# Altium schematic sheet IV_sensing.SchDoc: Triumvi - Sensing - IV Sensing
size Letter; Author: Ye-Sheng Kuo; Revision: 10; SheetNumber: 3; SheetTotal: 6
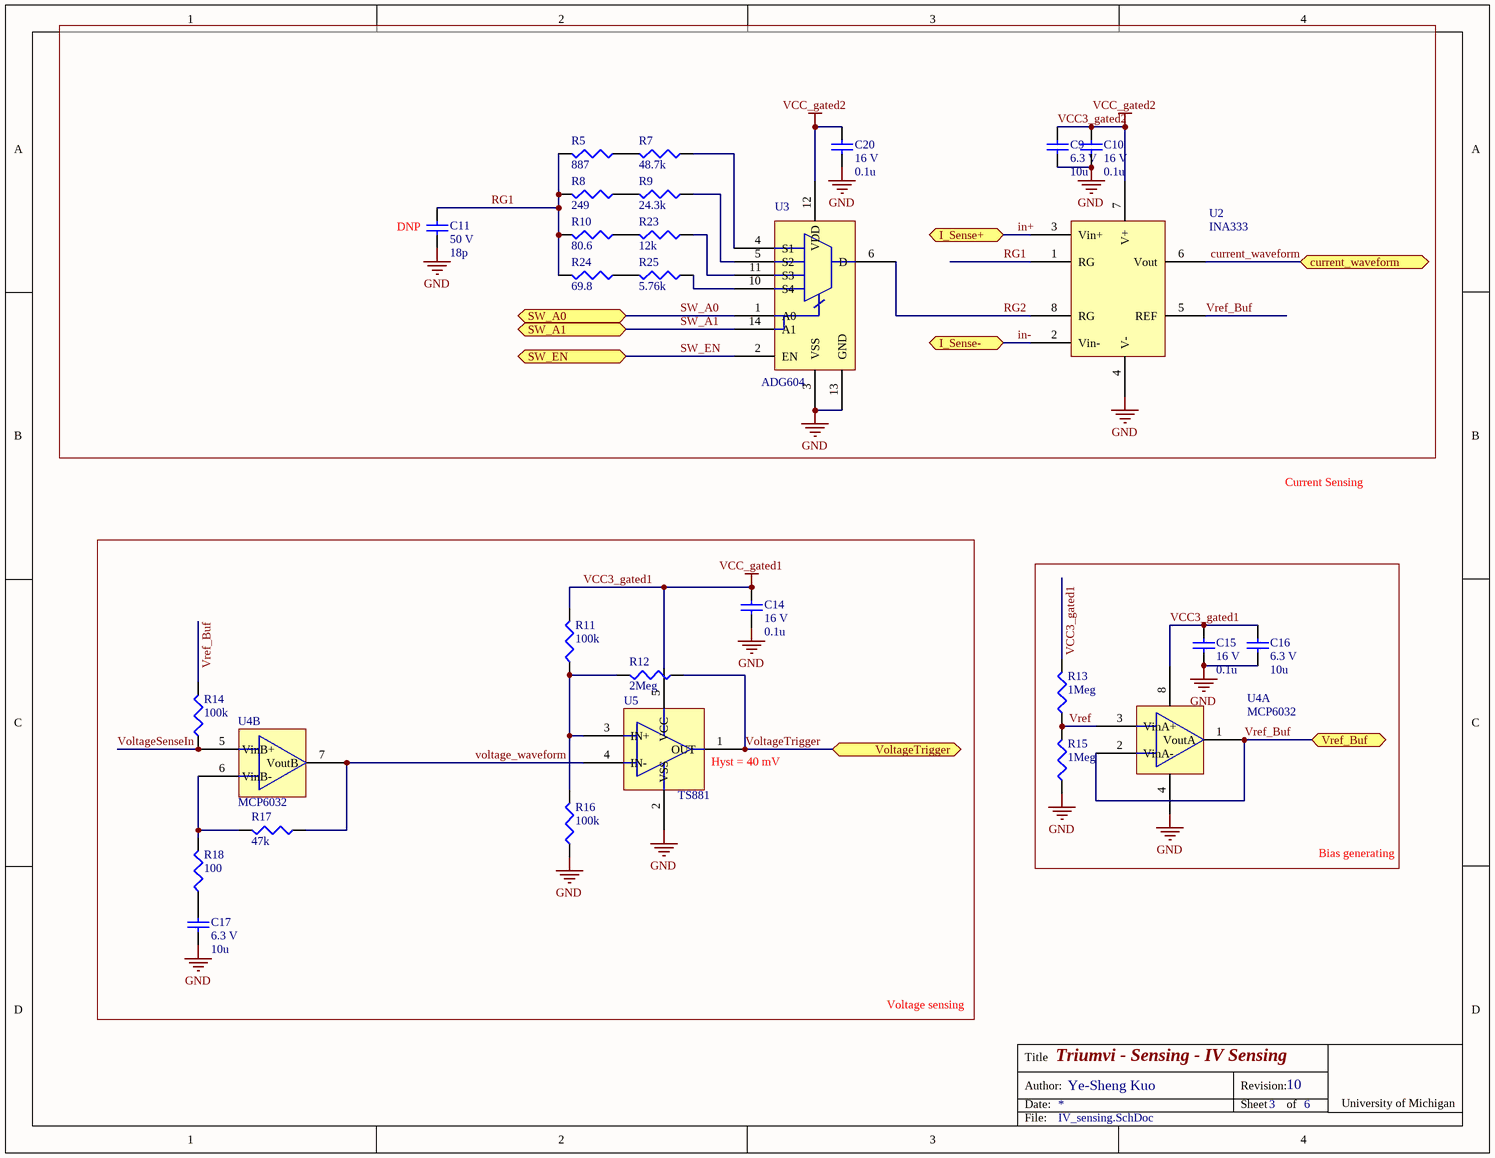
[diagram p0: IV_sensing.SchDoc]

## Parts
C9  voltage rated: 6.3 V  [0603]  (hidden comment: 10u)
C10  voltage rated: 16 V  [0402]  (hidden comment: 0.1u)
C11  voltage rated: 50 V  [0402]  (hidden comment: 18p)
C14  voltage rated: 16 V  [0402]  (hidden comment: 0.1u)
C15  voltage rated: 16 V  [0402]  (hidden comment: 0.1u)
C16  voltage rated: 6.3 V  [0603]  (hidden comment: 10u)
C17  voltage rated: 6.3 V  [0603]  (hidden comment: 10u)
C20  voltage rated: 16 V  [0402]  (hidden comment: 0.1u)
R5  887  [0402]
R7  48.7k  [0402]
R8  249  [0402]
R9  24.3k  [0402]
R10  80.6  [0402]
R11  100k  [0402]
R12  2Meg  [0402]
R13  1Meg  [0402]
R14  100k  [0402]
R15  1Meg  [0402]
R16  100k  [0402]
R17  47k  [0402]
R18  100  [0402]
R23  12k  [0402]
R24  69.8  [0402]
R25  5.76k  [0402]
U2  INA333  [MSOP-8]
U3  ADG604  [TSSOP-14]
U4  MCP6032  [MSOP-8]  (parts A,B of 2)
U5  TS881  [SC70-5]

## Blocks framed on the sheet
DNP: C9-C11 C20 R5 R7-R10 R23-R25 U2 U3
Bias generating: C15 C16 R13 R15 U4

## Ports
current_waveform, I_Sense+, I_Sense-, SW_A0, SW_A1, SW_EN, VoltageTrigger, Vref_Buf

## Nets
GND: C9.2 C10.2 C11.2 C14.2 C15.2 C16.2 C17.2 C20.2 R15.2 R16.2 U2.4(V-) U3.3(VSS) U3.13(GND) U4.4(VSS) U5.2(VSS)
VCC3_gated1: C14.1 C15.1 C16.1 R11.1 R13.1 U4.8(VDD) U5.5(VCC)  [also labelled VCC_gated1]
VCC3_gated2: C9.1 C10.1 C20.1 U2.7(V+) U3.12(VDD)  [also labelled VCC_gated2]
current_waveform: U2.6(Vout) ; port current_waveform
in+: U2.3(Vin+) ; port I_Sense+
in-: U2.2(Vin-) ; port I_Sense-
RG1: C11.1 R5.1 R8.1 R10.1 R24.1 U2.1(RG)
RG2: U2.8(RG) U3.6(D)
SW_A0: U3.1(A0) ; port SW_A0
SW_A1: U3.14(A1) ; port SW_A1
SW_EN: U3.2(EN) ; port SW_EN
voltage_waveform: R17.2 U4.7(VoutB) U5.4(IN-)
VoltageSenseIn: R14.2 U4.5(VinB+)
VoltageTrigger: R12.2 U5.1(OUT) ; port VoltageTrigger
Vref: R13.2 R15.1 U4.3(VinA+)
Vref_Buf: R14.1 U2.5(REF) U4.1(VoutA) U4.2(VinA-) ; port Vref_Buf
NetC17_1: C17.1 R18.2
NetR5_2: R5.2 R7.1
NetR7_2: R7.2 U3.4(S1)
NetR8_2: R8.2 R9.1
NetR9_2: R9.2 U3.5(S2)
NetR10_2: R10.2 R23.1
NetR11_2: R11.2 R12.1 R16.1 U5.3(IN+)
NetR17_1: R17.1 R18.1 U4.6(VinB-)
NetR23_2: R23.2 U3.11(S3)
NetR24_2: R24.2 R25.1
NetR25_2: R25.2 U3.10(S4)

## Notes on the sheet
- Current Sensing
- (near U5) Hyst = 40 mV
- Voltage sensing
- Title
- Date:
- Author:
- Revision:
- Sheet
- of
- University of Michigan
- File:

## Library data of the parts
C9 C16 C17 = C1608X5R0J106M080AB: 10µF ±20% 6.3V Ceramic Capacitor X5R 0603; Manufacture: TDK; tolerance: 20%; package: 0603; Supplier 1: Digi-Key; Supplier Part Number 1: 445-4112-1-ND; Value: 10u; Temperature Coefficient: X5R; Manufacturer Part Number: C1608X5R0J106M080AB
C10 C14 C15 C20 = GRM155R71C104KA88D: 0.10µF ±10% 16V Ceramic Capacitor X7R 0402; Manufacture: Murata; tolerance: 10%; package: 0402; Supplier 1: Digi-Key; Supplier Part Number 1: 490-3261-1-ND; Value: 0.1u; Temperature Coefficient: X7R; Manufacturer Part Number: GRM155R71C104KA88D
C11 = 500R07S180GV4T: 18pF ±2% 50V Ceramic Capacitor C0G, NP0 0402; Manufacture: Johanson Technology Inc.; Note: RF application; tolerance: 2%; package: 0402; Temperature Coefficient: C0G, NP0; Manufacturer Part Number: 500R07S180GV4T; Supplier 1: Digi-Key; Supplier Part Number 1: 712-1264-1-ND; Value: 18p
R5 = CRCW0402887RFKED: RES SMD 887 OHM 1% 1/16W 0402; Manufacturer: Vishay Dale; Temperature Coefficient: 100 ppm/C; package: 0402; Manufacturer Part Number: CRCW0402887RFKED; Power: 1/16 W; Tolerance: 1%; Supplier 1: Digi-Key; Supplier Part Number 1: 541-887LCT-ND; value: 887
R7 = RT0402DRD0748K7L: RES SMD 48.7K OHM 0.5% 1/16W 0402; Manufacturer: Yageo; Temperature Coefficient: 25 ppm/C; package: 0402; Manufacturer Part Number: RT0402DRD0748K7L; Power: 1/16 W; Tolerance: 0.5%; Supplier 1: Digi-Key; Supplier Part Number 1: 311-2188-1-ND; value: 48.7k
R8 = CRCW0402249RFKED: RES SMD 249 OHM 1% 1/16W 0402; Manufacturer: Vishay Dale; Temperature Coefficient: 100 ppm/C; package: 0402; Manufacturer Part Number: CRCW0402249RFKED; Power: 1/16 W; Tolerance: 1%; Supplier 1: Digi-Key; Supplier Part Number 1: 541-249LCT-ND; value: 249
R9 = RC0402FR-0724K3L: RES SMD 24.3K OHM 0.5% 1/16W 0402; Manufacturer: Yageo; Temperature Coefficient: 100 ppm/C; Tolerance: 1%; package: 0402; Manufacturer Part Number: RC0402FR-0724K3L; Power: 1/16 W; Supplier 1: Digi-Key; Supplier Part Number 1: YAG3071CT-ND; value: 24.3k
R10 = CRCW040280R6FKED: RES SMD 80.6 OHM 1% 1/16W 0402; Manufacturer: Vishay Dale; Temperature Coefficient: 100 ppm/C; package: 0402; Manufacturer Part Number: CRCW040280R6FKED; Power: 1/16 W; Tolerance: 1%; Supplier 1: Digi-Key; Supplier Part Number 1: 541-80.6LCT-ND; value: 80.6
R11 R14 R16 = CRCW0402100KFKED: RES SMD 100K OHM 1% 1/16W 0402; Manufacturer: Vishay Dale; Temperature Coefficient: 100 ppm/C; Tolerance: 1%; Power: 1/16 W; Supplier 1: Digi-Key; Supplier Part Number 1: 541-100KLCT-ND; package: 0402; value: 100k; Manufacturer Part Number: CRCW0402100KFKED
R12 = CRCW04022M00FKED: RES SMD 2M OHM 1% 1/16W 0402; Manufacturer: Vishay Dale; Temperature Coefficient: 100 ppm/C; Tolerance: 1%; Power: 1/16 W; package: 0402; Supplier 1: Digi-Key; Supplier Part Number 1: 541-2.00MLCT-ND; value: 2Meg; Manufacturer Part Number: CRCW04022M00FKED
R13 R15 = CRCW04021M00FKED: RES SMD 1M OHM 1% 1/16W 0402; Manufacturer: Vishay Dale; Temperature Coefficient: 100 ppm/C; Tolerance: 1%; Power: 1/16 W; Supplier 1: Digi-Key; Supplier Part Number 1: 541-1.00MLCT-ND; package: 0402; value: 1Meg; Manufacturer Part Number: CRCW04021M00FKED
R17 = CRCW040247K0FKED: RES SMD 47K OHM 1% 1/16W 0402; Manufacturer: Vishay Dale; Temperature Coefficient: 100 ppm/C; Tolerance: 1%; Power: 1/16 W; package: 0402; Supplier 1: Digi-Key; Supplier Part Number 1: 541-47.0KLCT-ND; value: 47k; Manufacturer Part Number: CRCW040247K0FKED
R18 = CRCW0402100RFKED: RES SMD 100 OHM 1% 1/16W 0402; Manufacturer: Vishay Dale; Temperature Coefficient: 100 ppm/C; Tolerance: 1%; Power: 1/16 W; package: 0402; Supplier 1: Digi-Key; Supplier Part Number 1: 541-100LCT-ND; value: 100; Manufacturer Part Number: CRCW0402100RFKED
R23 = RT0402DRD0712KL: RES SMD 12K OHM 0.5% 1/16W 0402; Manufacturer: Yageo; Temperature Coefficient: 25 ppm/C; package: 0402; Manufacturer Part Number: RT0402DRD0712KL; Power: 1/16 W; Tolerance: 0.5%; Supplier 1: Digi-Key; Supplier Part Number 1: 311-2140-1-ND; value: 12k
R24 = CRCW040269R8FKED: RES SMD 69.8 OHM 1% 1/16W 0402; Manufacturer: Vishay Dale; Temperature Coefficient: 100 ppm/C; package: 0402; Manufacturer Part Number: CRCW040269R8FKED; Power: 1/16 W; Tolerance: 1%; Supplier 1: Digi-Key; Supplier Part Number 1: 541-69.8LCT-ND; value: 69.8
R25 = RC0402FR-075K76L: RES SMD 5.76K OHM 0.5% 1/16W 0402; Manufacturer: Yageo; Temperature Coefficient: 100 ppm/C; Tolerance: 1%; package: 0402; Manufacturer Part Number: RC0402FR-075K76L; Power: 1/16 W; Supplier 1: Digi-Key; Supplier Part Number 1: YAG3196CT-ND; value: 5.76k
U2 = INA333: Micro-Power (50uA), Zero-Drift, Rail-to-Rail Out  Instrumentation Amplifier; Supplier 1: Digi-Key; Supplier Part Number 1: 296-23564-1-ND
U3 = ADG604: 1 pC Charge Injection, 100 pA Leakage  CMOS  5 V/5 V/3 V 4-Channel Multiplexer; Supplier 1: Digi-Key; Supplier Part Number 1: ADG604YRUZ-ND
U4 = MCP6032: 0.9 µA, High Precision Op Amps; Supplier 1: Digi-Key; Supplier Part Number 1: MCP6032-E/MS-ND
U5 = TS881: Rail-to-rail 0.9 V nanopower comparator; Supplier 1: Digi-Key; Supplier Part Number 1: 497-13217-1-ND